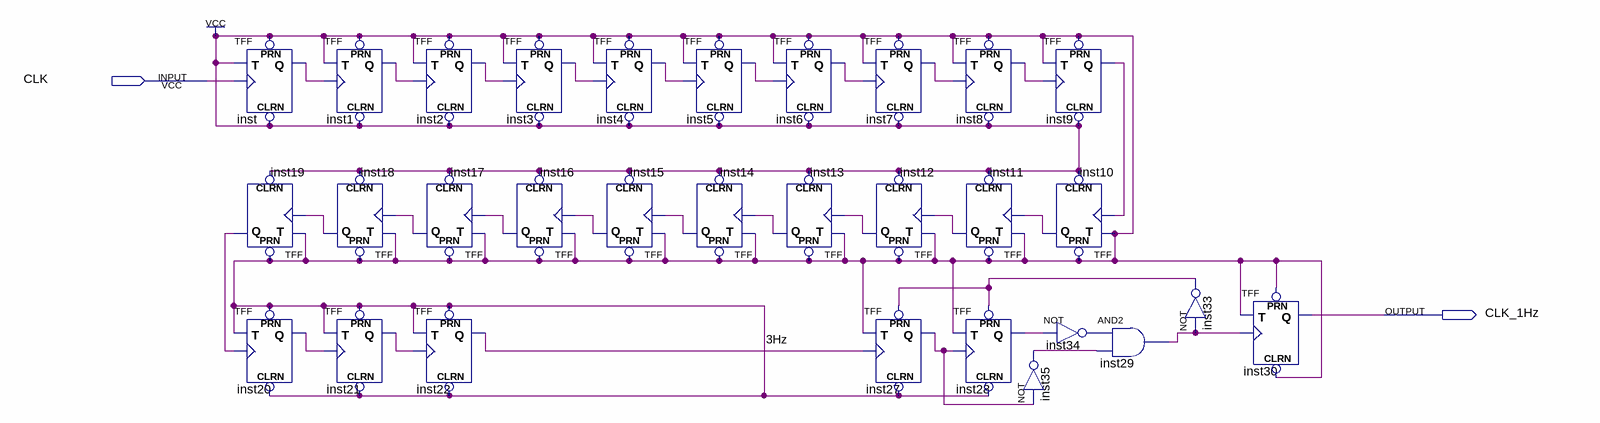
[diagram p0: schematic sheet]
// Quartus schematic CLK_1Hz.bdf as structural Verilog: 30 symbols, 2 pins
module CLK_1Hz (
  input  CLK,
  output CLK_1Hz
);

  wire \3Hz , inst1_q, inst2_q, inst3_q, inst4_q, inst5_q, inst6_q, inst7_q, inst8_q, inst9_q, inst10_q,
       inst11_q, inst12_q, inst13_q, inst14_q, inst15_q, inst16_q, inst17_q, inst18_q, inst19_q, inst20_q,
       inst21_q, inst27_q, inst28_q, inst29_out, inst33_out, inst34_out, inst35_out, inst_q;

  TFF inst (.PRN(1'b1), .CLRN(1'b1), .T(1'b1), .CLK(CLK), .Q(inst_q));
  TFF inst19 (.PRN(1'b1), .CLRN(1'b1), .T(1'b1), .CLK(inst18_q), .Q(inst19_q));
  TFF inst20 (.PRN(1'b1), .CLRN(1'b1), .T(1'b1), .CLK(inst19_q), .Q(inst20_q));
  TFF inst1 (.PRN(1'b1), .CLRN(1'b1), .T(1'b1), .CLK(inst_q), .Q(inst1_q));
  TFF inst18 (.PRN(1'b1), .CLRN(1'b1), .T(1'b1), .CLK(inst17_q), .Q(inst18_q));
  TFF inst21 (.PRN(1'b1), .CLRN(1'b1), .T(1'b1), .CLK(inst20_q), .Q(inst21_q));
  TFF inst2 (.PRN(1'b1), .CLRN(1'b1), .T(1'b1), .CLK(inst1_q), .Q(inst2_q));
  TFF inst17 (.PRN(1'b1), .CLRN(1'b1), .T(1'b1), .CLK(inst16_q), .Q(inst17_q));
  TFF inst22 (.PRN(1'b1), .CLRN(1'b1), .T(1'b1), .CLK(inst21_q), .Q(\3Hz ));
  TFF inst3 (.PRN(1'b1), .CLRN(1'b1), .T(1'b1), .CLK(inst2_q), .Q(inst3_q));
  TFF inst16 (.PRN(1'b1), .CLRN(1'b1), .T(1'b1), .CLK(inst15_q), .Q(inst16_q));
  TFF inst4 (.PRN(1'b1), .CLRN(1'b1), .T(1'b1), .CLK(inst3_q), .Q(inst4_q));
  TFF inst15 (.PRN(1'b1), .CLRN(1'b1), .T(1'b1), .CLK(inst14_q), .Q(inst15_q));
  TFF inst5 (.PRN(1'b1), .CLRN(1'b1), .T(1'b1), .CLK(inst4_q), .Q(inst5_q));
  TFF inst14 (.PRN(1'b1), .CLRN(1'b1), .T(1'b1), .CLK(inst13_q), .Q(inst14_q));
  TFF inst6 (.PRN(1'b1), .CLRN(1'b1), .T(1'b1), .CLK(inst5_q), .Q(inst6_q));
  TFF inst13 (.PRN(1'b1), .CLRN(1'b1), .T(1'b1), .CLK(inst12_q), .Q(inst13_q));
  TFF inst7 (.PRN(1'b1), .CLRN(1'b1), .T(1'b1), .CLK(inst6_q), .Q(inst7_q));
  TFF inst12 (.PRN(1'b1), .CLRN(1'b1), .T(1'b1), .CLK(inst11_q), .Q(inst12_q));
  TFF inst27 (.PRN(inst33_out), .CLRN(1'b1), .T(1'b1), .CLK(\3Hz ), .Q(inst27_q));
  TFF inst8 (.PRN(1'b1), .CLRN(1'b1), .T(1'b1), .CLK(inst7_q), .Q(inst8_q));
  TFF inst11 (.PRN(1'b1), .CLRN(1'b1), .T(1'b1), .CLK(inst10_q), .Q(inst11_q));
  TFF inst28 (.PRN(inst33_out), .CLRN(1'b1), .T(1'b1), .CLK(inst27_q), .Q(inst28_q));
  TFF inst9 (.PRN(1'b1), .CLRN(1'b1), .T(1'b1), .CLK(inst8_q), .Q(inst9_q));
  TFF inst10 (.PRN(1'b1), .CLRN(1'b1), .T(1'b1), .CLK(inst9_q), .Q(inst10_q));
  not inst34 (inst34_out, inst28_q);
  not inst35 (inst35_out, inst27_q);
  and inst29 (inst29_out, inst34_out, inst35_out);
  not inst33 (inst33_out, inst29_out);
  TFF inst30 (.PRN(1'b1), .CLRN(1'b1), .T(1'b1), .CLK(inst29_out), .Q(CLK_1Hz));
endmodule
